# Altium schematic sheet Serial.SchDoc
size A4
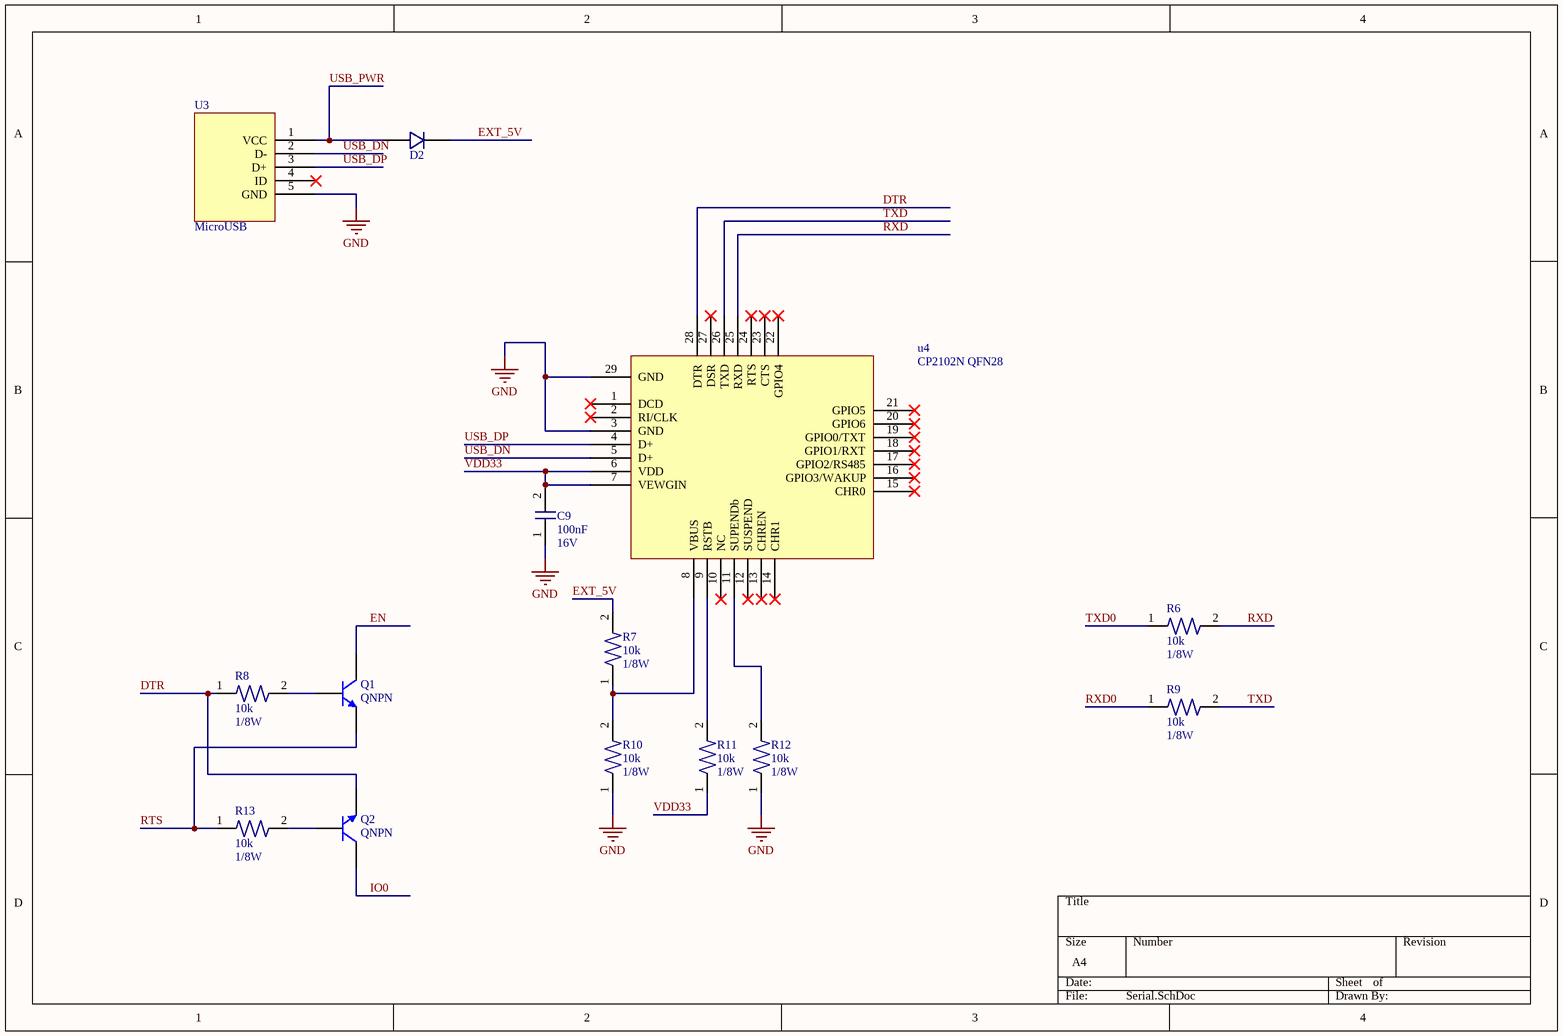
[diagram p0: Serial.SchDoc]

## Parts
C9  Capacitance: 100nF  Voltage: 16V  [CAP 100nF/16V]  (hidden comment: CAP 100nF/16V)
D2  ES1F  [ES1F SMA Package]  (value not drawn)
Q1  QNPN  [SOT-23B_N]
Q2  QNPN  [SOT-23B_N]
R6  Resistence: 10k  Power: 1/8W  [RES 10k 1% 1/8W]  (hidden comment: RES 0603)
R7  Resistence: 10k  Power: 1/8W  [RES 10k 1% 1/8W]  (hidden comment: RES 0603)
R8  Resistence: 10k  Power: 1/8W  [RES 10k 1% 1/8W]  (hidden comment: RES 0603)
R9  Resistence: 10k  Power: 1/8W  [RES 10k 1% 1/8W]  (hidden comment: RES 0603)
R10  Resistence: 10k  Power: 1/8W  [RES 10k 1% 1/8W]  (hidden comment: RES 0603)
R11  Resistence: 10k  Power: 1/8W  [RES 10k 1% 1/8W]  (hidden comment: RES 0603)
R12  Resistence: 10k  Power: 1/8W  [RES 10k 1% 1/8W]  (hidden comment: RES 0603)
R13  Resistence: 10k  Power: 1/8W  [RES 10k 1% 1/8W]  (hidden comment: RES 0603)
U3  MicroUSB  [MicroUSB]
u4  CP2102N QFN28  [CP2102N QFN28]

## Nets
GND: C9.1 R10.1 R12.1 U3.5(GND) u4.3(GND) u4.29(GND)
DTR: Q2.3(E) R8.1 u4.28(DTR)
EN: Q1.1(C)
EXT_5V: D2.K R7.2
IO0: Q2.1(C)
RTS: Q1.3(E) R13.1
RXD: R6.2 u4.25(RXD)
RXD0: R9.1
TXD: R9.2 u4.26(TXD)
TXD0: R6.1
USB_DN: U3.2(D-) u4.5(D+)
USB_DP: U3.3(D+) u4.4(D+)
USB_PWR: D2.A U3.1(VCC)
VDD33: C9.2 R11.1 u4.6(VDD) u4.7(VEWGIN)
NetQ1_2: Q1.2(B) R8.2
NetQ2_2: Q2.2(B) R13.2
NetR7_1: R7.1 R10.2 u4.8(VBUS)
NetR11_2: R11.2 u4.9(RSTB)
NetR12_2: R12.2 u4.11(SUPENDb)

Not connected (* = marked no-connect by the designer): U3 4(ID)*; u4 1(DCD)* 2(RI/CLK)* 10(NC)* 12(SUSPEND)* 13(CHREN)* 14(CHR1)* 15(CHR0)* 16(GPIO3/WAKUP)* 17(GPIO2/RS485)* 18(GPIO1/RXT)* 19(GPIO0/TXT)* 20(GPIO6)* 21(GPIO5)* 22(GPIO4)* 23(CTS)* 24(RTS)* 27(DSR)*

## Library data of the parts
C9 = CAP 100nF/16V: 0.1µF ±20% 16V Ceramic Capacitor Y5V (F) 0805 (2012 Metric); Manufacturer 1: Samsung Electro-Mechanics; Manufacturer 1 PN: CL21A106KOQNNWE; Mouser PN: 581-08055C104K4Z4A; Digikey PN: 1276-2894-1-ND; ComponentLink1Description: Specifications; ComponentLink1URL: http://www.samsungsem.com/kr/support/product-search/mlcc/__icsFiles/afieldfile/2018/07/27/CL21A106KOQNNWE.pdf
D2 = ES1F SMA: Diode Standard 300V 1A Surface Mount SMA (DO-214AC); Manufacturer 1: ON Semiconductor; Manufacturer 1 PN: ES1F; ComponentLink1Description: Datasheet; ComponentLink1URL: https://www.fairchildsemi.com/datasheets/ES/ES1F.pdf; Voltage: 300V; Current: 1A
Q1 Q2 = QNPN: NPN Bipolar Transistor; Published: 8-Jun-2000; LatestRevisionDate: 29-May-2009; LatestRevisionNote: IPC-7351 Footprint Added.; PackageVersion: Aug-1999; PackageReference: SOT-23B; Publisher: Altium Limited; PackageDescription: 3-Pin SOT-23 Package 0.95 mm Pitch, 2.4 mm Lead Span
R6-R13 = RES 10k 1% 1/8W: 10 kOhms ±1% 0.125W, 1/8W Chip Resistor 0603 (1608 Metric) Anti-Sulfur, Moisture Resistant Thin Film; Manufacturer 1: Stackpole Electronics Inc.; Manufacturer 1 PN: RNCP0603FTD10K0; Digikey PN: RNCP0603FTD10K0CT-ND; ComponentLink1Description: Datasheet; ComponentLink1URL: http://www.yageo.com/documents/recent/PYu-RC_Group_51_RoHS_L_9.pdf; Mouser PN: 755-ESR03EZPF1002
U3 = MicroUSB: ComponentLink1Description: LCSC; ComponentLink1URL: https://lcsc.com/product-detail/Micro-USB-Connectors_MICRO-5PFemaleBtype-High-temperature_C46390.html?currency=EUR; ComponentLink2Description: Datasheet; ComponentLink2URL: https://datasheet.lcsc.com/szlcsc/1912111436_LCSC-C46390_C46390.pdf